# EAGLE design transmitter (EAGLE 9.6.2)
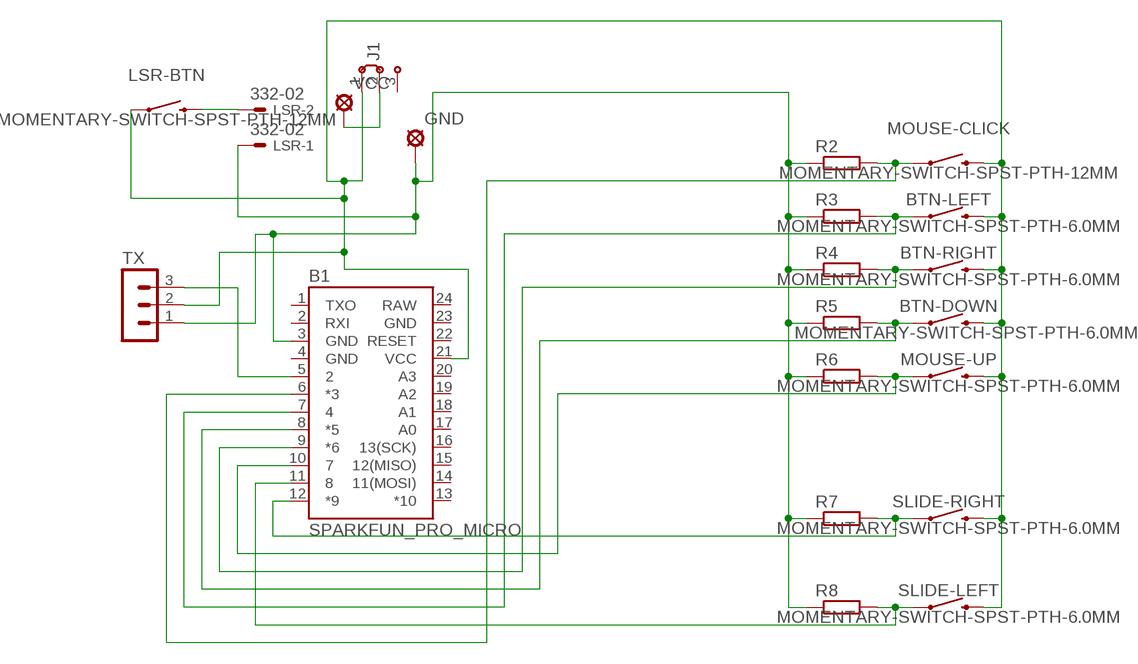
[diagram p0: schematic, sheet 1]

## Parts
B1  SPARKFUN_PRO_MICRO  [SPARKFUN_PRO_MICRO]
BTN-DOWN  MOMENTARY-SWITCH-SPST-PTH-6.0MM  [TACTILE_SWITCH_PTH_6.0MM]
BTN-LEFT  MOMENTARY-SWITCH-SPST-PTH-6.0MM  [TACTILE_SWITCH_PTH_6.0MM]
BTN-RIGHT  MOMENTARY-SWITCH-SPST-PTH-6.0MM  [TACTILE_SWITCH_PTH_6.0MM]
GND  SE13  [SE13]
J1  J2X5MM  [05C]
LSR  332-02  [332-02]
LSR-BTN  MOMENTARY-SWITCH-SPST-PTH-12MM  [TACTILE_SWITCH_PTH_12MM]
MOUSE-CLICK  MOMENTARY-SWITCH-SPST-PTH-12MM  [TACTILE_SWITCH_PTH_12MM]
MOUSE-UP  MOMENTARY-SWITCH-SPST-PTH-6.0MM  [TACTILE_SWITCH_PTH_6.0MM]
R2  R-EU_0204/7  [0204/7]
R3  R-EU_0204/7  [0204/7]
R4  R-EU_0204/7  [0204/7]
R5  R-EU_0204/7  [0204/7]
R6  R-EU_0204/7  [0204/7]
R7  R-EU_0204/7  [0204/7]
R8  R-EU_0204/7  [0204/7]
SLIDE-LEFT  MOMENTARY-SWITCH-SPST-PTH-6.0MM  [TACTILE_SWITCH_PTH_6.0MM]
SLIDE-RIGHT  MOMENTARY-SWITCH-SPST-PTH-6.0MM  [TACTILE_SWITCH_PTH_6.0MM]
TX  MA03-1  [MA03-1]
VCC  SE13  [SE13]

## Nets
N$1 [ground]: B1.9(*6) BTN-RIGHT.1 R4.2
N$2 [ground]: B1.3(GND) GND.MP LSR.1 R2.1 R3.1 R4.1 R5.1 R6.1 R7.1 R8.1 TX.1
N$3 [ground]: LSR-BTN.3 LSR.2
N$4 [ground]: B1.6(*3) MOUSE-CLICK.1 R2.2
N$5 [ground]: B1.7 BTN-LEFT.1 R3.2
N$6 [ground]: J1.2 VCC.MP
N$7 [ground]: B1.8(*5) BTN-DOWN.1 R5.2
N$8 [ground]: B1.10 MOUSE-UP.1 R6.2
N$9 [ground]: B1.12(*9) R7.2 SLIDE-RIGHT.1
N$10 [ground]: B1.11 R8.2 SLIDE-LEFT.1
N$11 [ground]: B1.21(VCC) BTN-DOWN.3 BTN-LEFT.3 BTN-RIGHT.3 J1.1 LSR-BTN.1 MOUSE-CLICK.3 MOUSE-UP.3 SLIDE-LEFT.3 SLIDE-RIGHT.3 TX.2
N$13 [ground]: B1.5 TX.3
Unconnected: B1.1(TXO) B1.2(RXI) B1.13(*10) B1.14(11(MOSI)) B1.15(12(MISO)) B1.16(13(SCK)) B1.17(A0) B1.18(A1) B1.19(A2) B1.20(A3) B1.22(RESET) J1.3

## Power pins joined to a net without a drawn wire
GND: B1.4(GND) B1.23(GND)
RAW: B1.24(RAW)

## Library data of the parts
B1 = SparkFun-Boards:SPARKFUN_PRO_MICRO: SparkFun Pro Micro Atmega32U4 compatible footprint. SparkFun Products: 3.3V/8MHz <https://www.sparkfun.com/products/12587> 5V/16MHz <https://www.sparkfun.com/products/12640>
BTN-DOWN BTN-LEFT BTN-RIGHT MOUSE-UP SLIDE-LEFT SLIDE-RIGHT = SparkFun-Switches:MOMENTARY-SWITCH-SPST: Momentary Switch (Pushbutton) - SPST Normally-open (NO) SPST momentary switches (buttons, pushbuttons). Variants PTH-12MM - 12mm square, through-hole Momentary Pushbutton Switch - 12mm Square <https://www.sparkfun.com/products/9190> (COM-09190) PTH-6.0MM, PTH-6.0MM-KIT - 6.0mm square, through-hole Mini Pushbutton Switch <https://www.sparkfun.com/products/97> (COM-00097) KIT package intended for soldering kit's - only one side of pads' copper is exposed. PTH-RIGHT-ANGLE-KIT - Right-angle, through-hole Right Angle Tactile Button <https://www.sparkfun.com/products/10791> - Used on SparkFun BigTime Watch Kit <https://www.sparkfun.com/products/11734> SMD-12MM - 12mm square, surface-mount Tactile Button - SMD (12mm) <https://www.sparkfun.com/products/12993> (COM-12993) Used on SparkFun PicoBoard <https://www.sparkfun.com/products/11888> SMD-4.5MM - 4.5mm Square Trackball Switch Used on SparkFun Blackberry Trackballer Breakout <https://www.sparkfun.com/products/13169> SMD-4.6MMX2.8MM - 4.60mm x 2.80mm, surface mount Used on SparkFun SAMD21 Mini Breakout <https://www.sparkfun.com/products/13664> SMD-5.2MM, SMD-5.2-REDUNDANT - 5.2mm square, surface-mount Mini Pushbutton Switch - SMD <https://www.sparkfun.com/products/8720> (COM-08720) Used on Arduino Pro Mini <https://www.sparkfun.com/products/11114> REDUNDANT package connects both switch circuits together SMD-6.0X3.5MM - 6.0 x 3.5mm, surface mount Momentary Reset Switch SMD <https://www.sparkfun.com/products/8229> (COM-08229) SMD-6.2MM-TALL - 6.2mm square, surface mount Tactile Button - SMD (6mm) <https://www.sparkfun.com/products/12992> Used on SparkFun Digital Sandbox <https://www.sparkfun.com/products/12651> SMD-RIGHT-ANGLE - Right-angle, surface mount Used on SparkFun Block for Intel® Edison - Arduino <https://www.sparkfun.com/products/13036>; PROD_ID: SWCH-08441; SF_SKU: COM-00097
GND VCC = solpad:SE13: SOLDER PAD E1542, drill 1,3mm, distributor Buerklin, 07F815
J1 = jumper:J2: Jumper switch 2 x 2.5 mm
LSR = con-garry:332-02: 2 Pin - 2mm Dual Row Source: www.mpe-connector.de / garry_shortform_2012.pdf
LSR-BTN MOUSE-CLICK = SparkFun-Switches:MOMENTARY-SWITCH-SPST: Momentary Switch (Pushbutton) - SPST Normally-open (NO) SPST momentary switches (buttons, pushbuttons). Variants PTH-12MM - 12mm square, through-hole Momentary Pushbutton Switch - 12mm Square <https://www.sparkfun.com/products/9190> (COM-09190) PTH-6.0MM, PTH-6.0MM-KIT - 6.0mm square, through-hole Mini Pushbutton Switch <https://www.sparkfun.com/products/97> (COM-00097) KIT package intended for soldering kit's - only one side of pads' copper is exposed. PTH-RIGHT-ANGLE-KIT - Right-angle, through-hole Right Angle Tactile Button <https://www.sparkfun.com/products/10791> - Used on SparkFun BigTime Watch Kit <https://www.sparkfun.com/products/11734> SMD-12MM - 12mm square, surface-mount Tactile Button - SMD (12mm) <https://www.sparkfun.com/products/12993> (COM-12993) Used on SparkFun PicoBoard <https://www.sparkfun.com/products/11888> SMD-4.5MM - 4.5mm Square Trackball Switch Used on SparkFun Blackberry Trackballer Breakout <https://www.sparkfun.com/products/13169> SMD-4.6MMX2.8MM - 4.60mm x 2.80mm, surface mount Used on SparkFun SAMD21 Mini Breakout <https://www.sparkfun.com/products/13664> SMD-5.2MM, SMD-5.2-REDUNDANT - 5.2mm square, surface-mount Mini Pushbutton Switch - SMD <https://www.sparkfun.com/products/8720> (COM-08720) Used on Arduino Pro Mini <https://www.sparkfun.com/products/11114> REDUNDANT package connects both switch circuits together SMD-6.0X3.5MM - 6.0 x 3.5mm, surface mount Momentary Reset Switch SMD <https://www.sparkfun.com/products/8229> (COM-08229) SMD-6.2MM-TALL - 6.2mm square, surface mount Tactile Button - SMD (6mm) <https://www.sparkfun.com/products/12992> Used on SparkFun Digital Sandbox <https://www.sparkfun.com/products/12651> SMD-RIGHT-ANGLE - Right-angle, surface mount Used on SparkFun Block for Intel® Edison - Arduino <https://www.sparkfun.com/products/13036>; PROD_ID: SWCH-09185; SF_SKU: COM-09190
R2-R8 = rcl:R-EU_: RESISTOR, European symbol; SPICEPREFIX: R
TX = con-lstb:MA03-1: PIN HEADER; OC_FARNELL: unknown; OC_NEWARK: unknown

## Net classes
0 default: width 0.305 mm, drill 0.305 mm, clearance 0.305 mm
1 ground: width 0.305 mm, drill 0.305 mm, clearance 0.305 mm

## Board
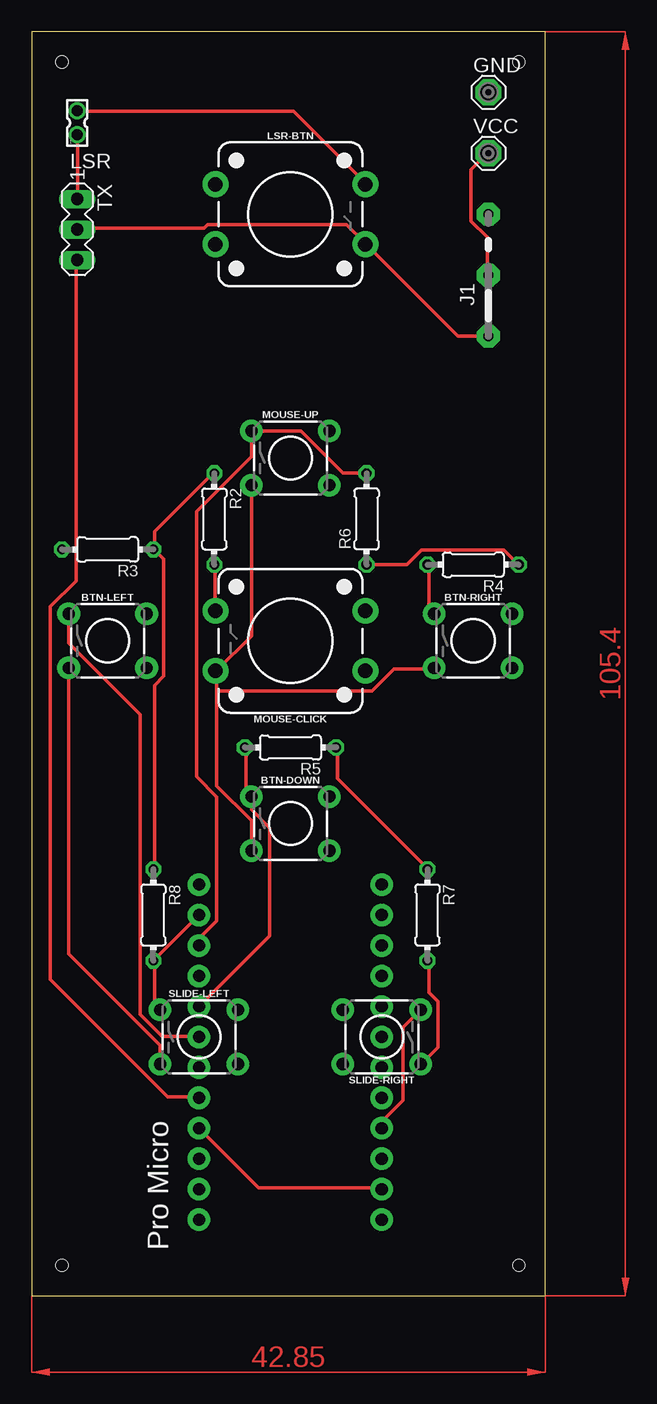
[diagram p1: board, top side]
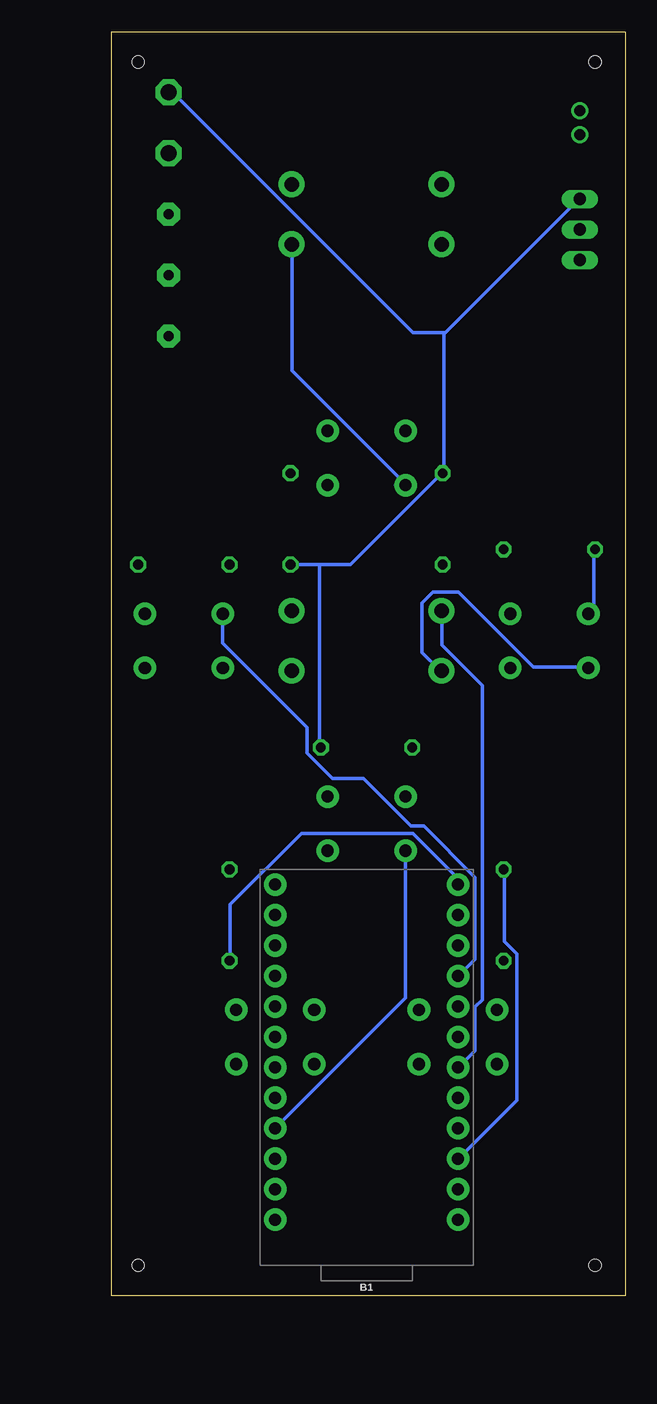
[diagram p2: board, bottom side, seen from below]

Size 42.85 x 105.4 mm. Coordinates in mm from the lower left corner, seen from the top.
Outline: 0,0 42.85,0 42.85,105.4 0,105.4 0,0
Copper layers (1*16): Top 0.035mm / dielectric 1.5mm / Bottom 0.035mm
Design rules "default": minimum track width 6mil, minimum drill 0.35mm, track to track 6mil, track to pad 6mil, pad to pad 6mil, via to via 6mil, smd to smd 6mil, copper to edge 40mil, drill to drill 6mil, minimum pad ring 10mil, minimum via ring 8mil, stop-mask expansion 4mil, vias tented up to drill 0mil, thermal gap 10mil
Holes 1 mm at 2.54,102.87 40.64,102.87 40.64,2.54 2.54,2.54

### Footprints (pad centres in the part's own frame; a part is rotated, then mirrored left to right if it is on the bottom)
SPARKFUN_PRO_MICRO = drill 1.016 pad 1.88: 1 -7.62,12.7; 2 -7.62,10.16; 3 -7.62,7.62; 4 -7.62,5.08; 5 -7.62,2.54; 6 -7.62,0; 7 -7.62,-2.54; 8 -7.62,-5.08; 9 -7.62,-7.62; 10 -7.62,-10.16; 11 -7.62,-12.7; 12 -7.62,-15.24; 13 7.62,-15.24; 14 7.62,-12.7; 15 7.62,-10.16; 16 7.62,-7.62; 17 7.62,-5.08; 18 7.62,-2.54; 19 7.62,0; 20 7.62,2.54; 21 7.62,5.08; 22 7.62,7.62; 23 7.62,10.16; 24 7.62,12.7
TACTILE_SWITCH_PTH_6.0MM = drill 1.016 pad 1.88: 1 -3.251,2.261; 2 3.251,2.261; 3 -3.251,-2.261; 4 3.251,-2.261
SE13 = drill 1.321 pad 2.159 octagon: MP 0,0
05C = drill 0.813 pad 1.905 octagon: 1 -2.54,0; 2 2.54,0; 3 7.62,0
332-02 = drill 0.9 pad 1.27: 1 0,-1; 2 0,1
TACTILE_SWITCH_PTH_12MM = drill 1.2 pad 2.159: 1 6.25,-2.5; 2 -6.25,-2.5; 3 6.25,2.5; 4 -6.25,2.5
0204/7 = drill 0.813 octagon: 1 -3.81,0; 2 3.81,0
MA03-1 = drill 1.016 long: 1 -2.54,0; 2 0,0; 3 2.54,0

### Placement (x,y rotation side)
B1  21.59,19.05 180 bottom
BTN-DOWN  21.59,39.37 0 top
BTN-LEFT  6.35,54.61 0 top
BTN-RIGHT  36.83,54.61 0 top
GND  38.1,100.33 0 top
J1  38.1,82.55 90 top
LSR  3.81,97.79 0 top
LSR-BTN  21.59,90.17 0 top
MOUSE-CLICK  21.59,54.61 180 top
MOUSE-UP  21.59,69.85 0 top
R2  15.24,64.77 270 top
R3  6.35,62.23 180 top
R4  36.83,60.96 180 top
R5  21.59,45.72 180 top
R6  27.94,64.77 90 top
R7  33.02,31.75 270 top
R8  10.16,31.75 270 top
SLIDE-LEFT  13.97,21.59 0 top
SLIDE-RIGHT  29.21,21.59 180 top
TX  3.81,88.9 270 top
VCC  38.1,95.25 0 top

### Tracks (layer width: path | path; a pad name or v marks a point on that pad's centre or on a via)
GND
  Top 0.305: B1.4 18.95,8.99 29.16,8.99 B1.23
N$1
  Top 0.152: 33.05,60.96 R4.2 | 33.58,56.92 BTN-RIGHT.1
  Top 0.305: R4.2 33.12,60.96 33.12,57.45 33.58,57 BTN-RIGHT.1
  Bottom 0.305: BTN-RIGHT.1 33.58,56.84 33.58,54.41 26.57,47.4 26.57,45.26 24.44,43.13 21.84,43.13 17.88,39.17 16.81,39.17 12.55,34.9 12.55,28.04 13.92,26.67 B1.9
N$2
  Top 0.152: 10.19,62.26 R3.1 | 15.21,68.58 R2.1 15.67,68.58 | 32.97,35.51 R7.1 32.97,35.59 | 10.19,35.59 R8.1
  Top 0.305: R5.1 25.5,45.72 25.5,43.13 32.97,35.66 R7.1 | R6.1 31.29,60.96 32.51,62.18 39.37,62.18 40.59,60.96 R4.1 | LSR.1 3.86,96.77 3.86,91.44 TX.1 | R2.1 15.14,68.58 10.26,63.7 10.26,62.33 R3.1 10.26,62.18 11.02,61.42 11.02,51.66 10.26,50.9 10.26,35.66 R8.1
  Bottom 0.152: 38.07,100.28 GND.MP | 3.86,96.85 LSR.1 | 3.86,91.06 3.86,91.14 3.86,91.44 TX.1 | 15.21,68.58 R2.1
  Bottom 0.305: R8.1 10.11,35.51 10.11,29.57 9.04,28.5 9.04,16.31 13.92,11.43 B1.3 | 15.06,80.24 15.14,80.16 15.14,68.58 R2.1 15.29,68.58 22.91,60.96 25.5,60.96 | 15.06,80.24 4.17,91.14 3.86,91.14 TX.1 | GND.MP 38,100.28 37.69,100.28 17.73,80.31 15.14,80.31 15.06,80.24 | 25.5,60.96 R6.1 | 25.5,60.96 25.5,45.72 R5.1
N$3
  Top 0.152: 27.79,92.73 LSR-BTN.3
  Top 0.305: LSR.2 3.86,98.75 21.84,98.75 27.79,92.81 LSR-BTN.3
N$4
  Top 0.305: R2.2 15.29,60.96 15.29,57.15 MOUSE-CLICK.1
  Bottom 0.305: MOUSE-CLICK.1 15.29,57 15.29,54.25 11.94,50.9 11.94,24.69 12.55,24.08 12.55,20.42 13.92,19.05 B1.6
N$5
  Top 0.152: 2.56,62.18 R3.2 | 3.1,56.92 BTN-LEFT.1
  Top 0.305: BTN-LEFT.1 3.1,56.84 3.1,54.41 9.04,48.46 9.04,23.47 10.87,21.64 13.92,21.64 B1.7
  Bottom 0.305: R3.2 2.64,62.18 2.64,57.45 3.1,57 BTN-LEFT.1
N$6
  Top 0.152: 38.15,85.11 J1.2 | 38.15,95.25 VCC.MP
  Top 0.305: J1.2 38,85.19 38,88.24 36.63,89.61 36.63,93.88 38,95.25 VCC.MP
N$7
  Top 0.152: 17.8,45.72 R5.2
  Top 0.305: R5.2 17.88,45.72 17.88,42.22 18.34,41.76 BTN-DOWN.1 18.34,40.54 19.86,39.01 19.86,30.02 B1.8
  Bottom 0.152: 18.34,41.6 BTN-DOWN.1
N$8
  Top 0.305: R6.2 25.96,68.58 22.45,72.08 18.34,72.08 | 18.34,72.08 18.34,69.95 13.77,65.38 13.77,43.28 15.44,41.6 15.44,31.24 14.07,29.87 14.07,29.26 B1.10 | 18.34,72.08 MOUSE-UP.1
N$9
  Top 0.152: 33.05,27.89 R7.2
  Top 0.305: R7.2 33.12,27.89 33.12,25.3 33.88,24.54 33.88,20.73 32.51,19.36 SLIDE-RIGHT.1
  Bottom 0.305: R7.2 32.97,28.04 32.97,32.61 27.03,38.56 17.73,38.56 14.07,34.9 14.07,34.29 B1.12
N$10
  Top 0.305: SLIDE-LEFT.1 10.72,23.93 10.26,24.38 10.26,27.89 R8.2 B1.11
N$11
  Top 0.152: 3.86,88.92 TX.2 | 27.79,87.71 LSR-BTN.1 27.86,87.63 | 15.29,52.05 MOUSE-CLICK.3
  Top 0.305: SLIDE-LEFT.3 10.72,20.88 3.1,28.5 BTN-LEFT.3 | TX.2 3.86,89 14.38,89 14.68,89.31 26.26,89.31 27.79,87.78 LSR-BTN.1 27.94,87.63 35.56,80.01 J1.1 | B1.21 29.31,14.02 29.31,14.63 30.99,16.31 30.99,22.4 32.36,23.77 SLIDE-RIGHT.3 | BTN-DOWN.3 18.34,39.62 15.44,42.52 15.44,50.44 | 15.44,50.44 15.44,51.97 MOUSE-CLICK.3 15.44,52.12 18.34,55.02 MOUSE-UP.3 | 15.44,50.44 28.4,50.44 30.23,52.27 33.58,52.27 BTN-RIGHT.3
  Bottom 0.152: 15.37,52.05 MOUSE-CLICK.3 | 19.25,67.59 MOUSE-UP.3
  Bottom 0.305: B1.21 18.34,24.84 BTN-DOWN.3 | LSR-BTN.1 27.79,87.63 27.79,77.11 18.34,67.67 MOUSE-UP.3 | BTN-LEFT.3 3.1,52.43 7.67,52.43 13.92,58.67 16.05,58.67 16.97,57.76 16.97,53.65 15.44,52.12 MOUSE-CLICK.3
N$13
  Top 0.305: TX.3 3.71,86.26 3.71,59.59 1.57,57.45 1.57,26.36 11.33,16.61 13.92,16.61 B1.5
(copper drawn outside any net)
  shapes: Top area x2

### Text on the board
tNames: Pro Micro